# EAGLE design digit (EAGLE 6.1)
APVD: B.F. (15-01-03); DOC_ID: CLK-SCH-05; DOC_PART_NO: CLK-PC-05; DOC_REV: B; DOC_TITLE: Display (model B) - 7 seg. display; PROJECT_NAME: Alarm Clock (Model B)
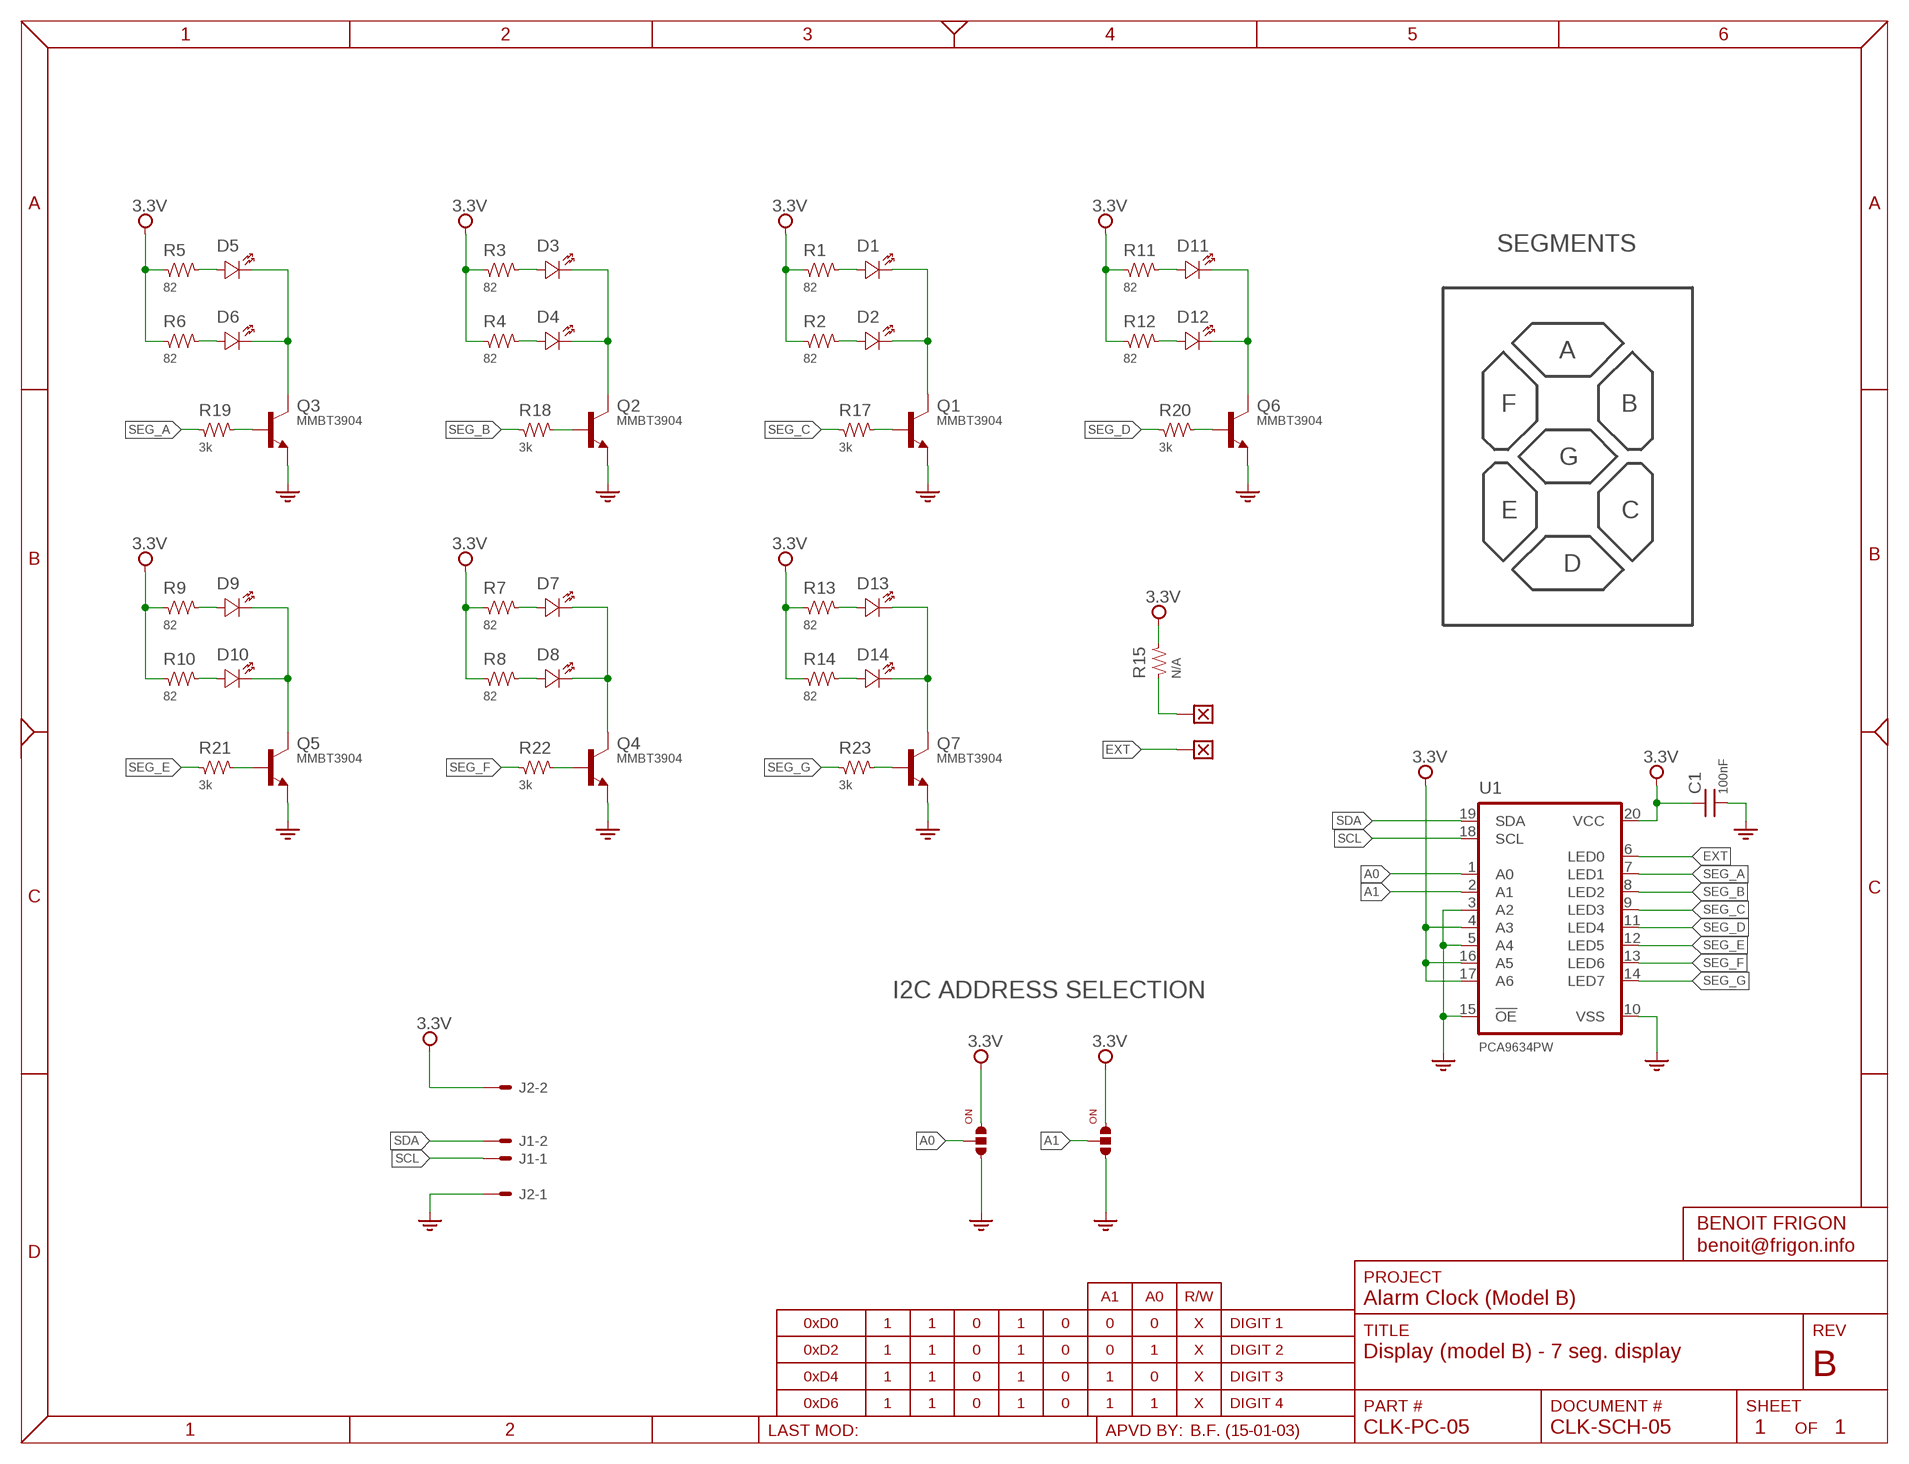
[diagram p0: schematic, sheet 1]

## Parts
C1  100nF  CAP-0603  [SMD_0603]
D1  Orange  LED-0805  [CHIPLED_0805]
D2  Orange  LED-0805  [CHIPLED_0805]
D3  Orange  LED-0805  [CHIPLED_0805]
D4  Orange  LED-0805  [CHIPLED_0805]
D5  Red  LED-0805  [CHIPLED_0805]
D6  orange  LED-0805  [CHIPLED_0805]
D7  Orange  LED-0805  [CHIPLED_0805]
D8  Orange  LED-0805  [CHIPLED_0805]
D9  Orange  LED-0805  [CHIPLED_0805]
D10  Orange  LED-0805  [CHIPLED_0805]
D11  Orange  LED-0805  [CHIPLED_0805]
D12  Orange  LED-0805  [CHIPLED_0805]
D13  Orange  LED-0805  [CHIPLED_0805]
D14  Orange  LED-0805  [CHIPLED_0805]
J1  DL-100-HEADER-02-EDGE  [HDR100-EDGE-2]
J2  DL-100-HEADER-02-EDGE  [HDR100-EDGE-2]
J10  SOLDER_JUMPER_3  [SOLDER_JUMPER_3]
J11  SOLDER_JUMPER_3  [SOLDER_JUMPER_3]
Q1  MMBT3904  [SOT23]
Q2  MMBT3904  [SOT23]
Q3  MMBT3904  [SOT23]
Q4  MMBT3904  [SOT23]
Q5  MMBT3904  [SOT23]
Q6  MMBT3904  [SOT23]
Q7  MMBT3904  [SOT23]
R1  82  RES-0603  [SMD_0603]
R2  82  RES-0603  [SMD_0603]
R3  82  RES-0603  [SMD_0603]
R4  82  RES-0603  [SMD_0603]
R5  82  RES-0603  [SMD_0603]
R6  82  RES-0603  [SMD_0603]
R7  82  RES-0603  [SMD_0603]
R8  82  RES-0603  [SMD_0603]
R9  82  RES-0603  [SMD_0603]
R10  82  RES-0603  [SMD_0603]
R11  82  RES-0603  [SMD_0603]
R12  82  RES-0603  [SMD_0603]
R13  82  RES-0603  [SMD_0603]
R14  82  RES-0603  [SMD_0603]
R15  N/A  RES-0603  [SMD_0603]
R17  3k  RES-0603  [SMD_0603]
R18  3k  RES-0603  [SMD_0603]
R19  3k  RES-0603  [SMD_0603]
R20  3k  RES-0603  [SMD_0603]
R21  3k  RES-0603  [SMD_0603]
R22  3k  RES-0603  [SMD_0603]
R23  3k  RES-0603  [SMD_0603]
U1  PCA9634PW  [TSSOP20]
W5  WIRE  [WIRE_SMT]
W6  WIRE  [WIRE_SMT]

## Nets
3.3V: C1.1 J2.2 J10.1 J11.1 R1.1 R2.1 R3.1 R4.1 R5.1 R6.1 R7.1 R8.1 R9.1 R10.1 R11.1 R12.1 R13.1 R14.1 R15.2 U1.4(A3) U1.16(A5) U1.17(A6) U1.20(VCC)
A0: J10.2 U1.1(A0)
A1: J11.2 U1.2(A1)
EXT: U1.6(LED0) W5.1
GND: C1.2 J2.1 J10.3 J11.3 Q1.2(E) Q2.2(E) Q3.2(E) Q4.2(E) Q5.2(E) Q6.2(E) Q7.2(E) U1.3(A2) U1.5(A4) U1.10(VSS) U1.15(!OE)
N$1: Q1.1(B) R17.2
N$2: D7.K D8.K Q4.3(C)
N$3: D13.K D14.K Q7.3(C)
N$4: D1.K D2.K Q1.3(C)
N$5: D3.K D4.K Q2.3(C)
N$6: D5.K D6.K Q3.3(C)
N$7: D3.A R3.2
N$8: D4.A R4.2
N$9: D14.A R14.2
N$10: D13.A R13.2
N$11: D2.A R2.2
N$12: D1.A R1.2
N$13: D5.A R5.2
N$14: D6.A R6.2
N$15: D11.A R11.2
N$16: D9.K D10.K Q5.3(C)
N$17: D11.K D12.K Q6.3(C)
N$18: D12.A R12.2
N$19: D10.A R10.2
N$20: D9.A R9.2
N$21: D7.A R7.2
N$22: D8.A R8.2
N$23: Q2.1(B) R18.2
N$24: Q3.1(B) R19.2
N$25: Q6.1(B) R20.2
N$26: Q5.1(B) R21.2
N$27: Q4.1(B) R22.2
N$28: Q7.1(B) R23.2
N$30: R15.1 W6.1
SCL: J1.1 U1.18(SCL)
SDA: J1.2 U1.19(SDA)
SEG_A: R19.1 U1.7(LED1)
SEG_B: R18.1 U1.8(LED2)
SEG_C: R17.1 U1.9(LED3)
SEG_D: R20.1 U1.11(LED4)
SEG_E: R21.1 U1.12(LED5)
SEG_F: R22.1 U1.13(LED6)
SEG_G: R23.1 U1.14(LED7)

## Notes on the sheet
- SEGMENTS
- A
- F | B
- G
- E | C
- D
- I2C ADDRESS SELECTION

## Library data of the parts
C1 = Passive:CAP: Capacitor; DESCRIPTION: {DESCRIPTION} - SMT 0603 - {value}; PACKAGE: SMT 0603
D1-D14 = Optoelectronic:LED: Led; COLOR: Orange; DESCRIPTION: {DESCRIPTION} Chip 0805 - {ATTR:COLOR}; MFG: Kingbright; PACKAGE: SMT 0805; PART_NO: APT2012SECK/J4-PRV; VALUE: {ATTR:COLOR}
J1 J2 = Connectors:DL-100-HEADER-02: 2 Pos - Dual Row - 2.54mm; MFG: Molex; PART_NO: 3-644456-2
J10 J11 = Misc:SOLDER_JUMPER_3; BOM: False; SKU: -
Q1-Q7 = Transistor:MMBT3904: NPN Transistor
R1-R15 R17-R23 = Passive:RES: Resistor; DESCRIPTION: {DESCRIPTION} - SMT 0603 - {VALUE}; PACKAGE: SMT 0603
U1 = IC:PCA9634: 8-bit fm+ i2c-bus LED driver The PCA9634 is an I2C-bus controlled 8-bit LED driver optimized for Red/Green/Blue/Amber (RGBA) color mixing applications. Each LED output has its own 8-bit resolution (256 steps) fixed frequency Individual PWM controller that operates at 97 kHz with a duty cycle that is adjustable from 0 % to 99.6 % to allow the LED to be set to a specific brightness value. An additional 8-bit resolution (256 steps) Group PWM controller has both a fixed frequency of 190 Hz and an adjustable frequency between 24 Hz to once every 10.73 seconds with a duty cycle that is adjustable from 0 % to 99.6 % that is used to either dim or blink all LEDs with the same value. Features 8 LED drivers. Each output programmable at: Off On Programmable LED brightness Programmable group dimming/blinking mixed with individual LED brightness 1 MHz Fast-mode Plus compatible I2C-bus interface with 30 mA high drive capability on SDA output for driving high capacitive buses 256-step (8-bit) linear programmable brightness per LED output varying from fully off (default) to maximum brightness using a 97 kHz PWM signal 256-step group brightness control allows general dimming (using a 190 Hz PWM signal) from fully off to maximum brightness (default) 256-step group blinking with frequency programmable from 24 Hz to 10.73 s and duty cycle from 0 % to 99.6 % Eight totem-pole outputs (sink 25 mA and source 10 mA at 5 V) with software programmable open-drain LED outputs selection (default at totem-pole). No input function. Output state change programmable on the Acknowledge or the STOP Command to update outputs byte-by-byte or all at the same time (default to ‘Change on STOP’). Active LOW Output Enable (OE) input pin. LED outputs programmable to 1, 0 or ‘high-impedance’ (default at power-up) when OE is HIGH, thus allowing hardware blinking and dimming of the LEDs. 7 hardware address pins allow 126 devices to be connected to the same I2C-bus 4 software programmable I2C-bus addresses (one LED Group Call address and three LED Sub Call addresses) allow groups of devices to be addressed at the same time in any combination (for example, one register used for ‘All Call’ so that all the PCA9634s on the I2C-bus can be addressed at the same time and the second register used for three different addresses so that 1⁄3 of all devices on the bus can be addressed at the same time in a group). Software enable and disable for I2C-bus address. Software Reset feature (SWRST Call) allows the device to be reset through the I2C-bus 25 MHz internal oscillator requires no external components Internal power-on reset Noise filter on SDA/SCL inputs Edge rate control on outputs No glitch on power-up Supports hot insertion Low standby current Operating power supply voltage range of 2.3 V to 5.5 V 5.5 V tolerant inputs; MFG: NXP Semiconductors
W5 W6 = Misc:WIRE; BOM: False

## Board
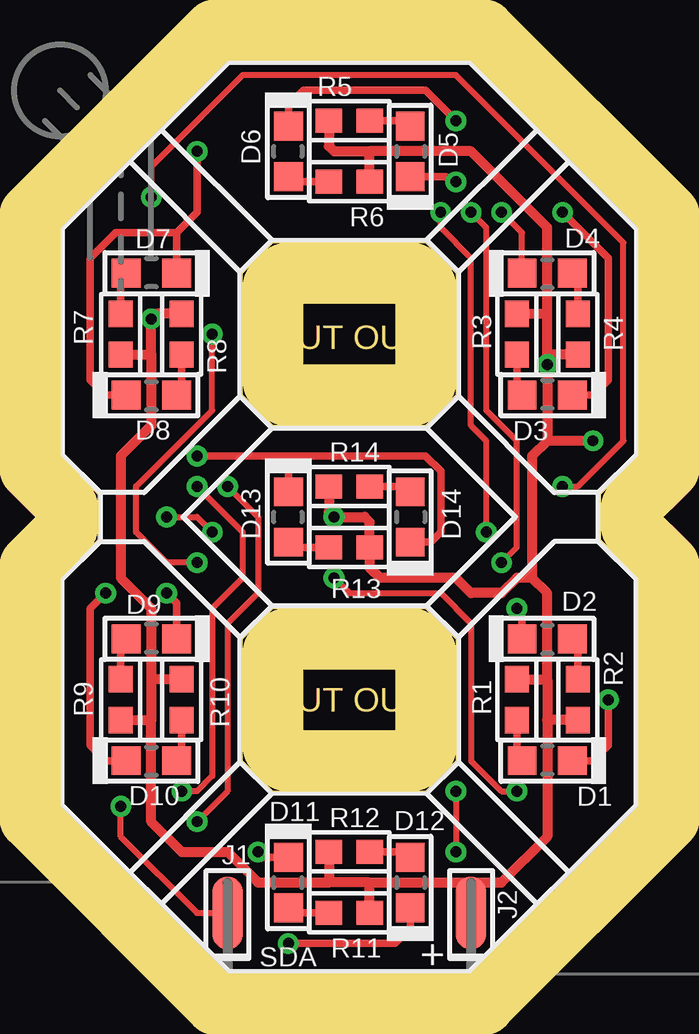
[diagram p1: board, top side]
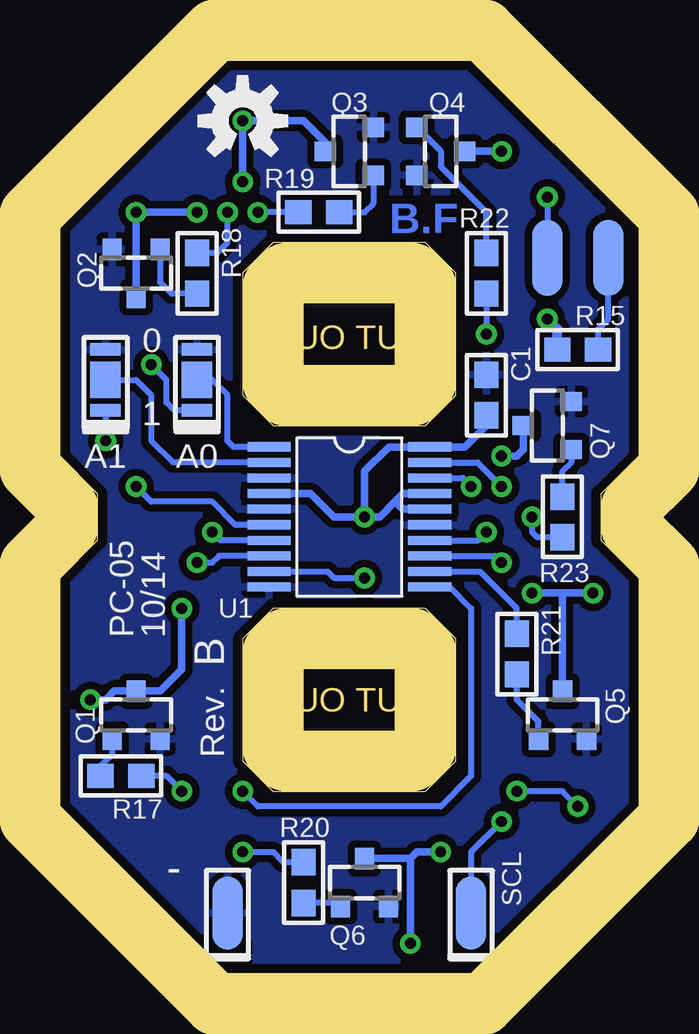
[diagram p2: board, bottom side, seen from below]

Size 24.13 x 38.1 mm. Coordinates in mm from the lower left corner, seen from the top.
Outline: 6.99,0 17.14,0 24.13,6.99 24.13,16.51 22.55,18.09 22.55,20.02 24.13,21.59 24.13,31.11 17.14,38.1 6.99,38.1 0,31.11 0,21.59 1.57,20.02 1.57,18.09 0,16.51 0,6.99 6.99,0
Outline: 8.89,7.62 7.62,8.89 7.62,13.97 8.89,15.24 15.24,15.24 16.51,13.97 16.51,8.89 15.24,7.62 8.89,7.62
Outline: 15.24,22.86 8.89,22.86 7.62,24.13 7.62,29.21 8.89,30.48 15.24,30.48 16.51,29.21 16.51,24.13 15.24,22.86
Copper layers (1*16): Top 0.035mm / dielectric 1.5mm / Bottom 0.035mm
Design rules: minimum track width 8mil, minimum drill 16mil, track to track 8mil, track to pad 8mil, pad to pad 8mil, via to via 8mil, smd to smd 8mil, copper to edge 16mil, drill to drill 8mil, minimum pad ring 10mil, minimum via ring 8mil, stop-mask expansion 4mil, vias tented up to drill 24mil, thermal gap 10mil
bRestrict: area 6.3,-0.6 to 7.6,1.3; area 16.5,-0.6 to 17.8,1.3
Milling: 33 lines

### Footprints (pad centres in the part's own frame; a part is rotated, then mirrored left to right if it is on the bottom)
SMD_0603 = smd 1.1 x 1: 1 -0.85,0; 2 0.85,0
CHIPLED_0805 = smd 1.2 x 1.2: A 0,-1.05; K 0,1.05
HDR100-EDGE-2 = smd 1.27 x 3.048 bottom: 1 0,0 | smd 1.27 x 3.048: 2 0,0
SOLDER_JUMPER_3 = smd 0.508 x 1.27: 1 -1.27,0; 3 1.27,0 | smd 1.524 x 1.27: 2 0,0
SOT23 = smd 0.8 x 0.9: 1 -1,-1; 2 1,-1; 3 0,1
TSSOP20 = smd 0.38 x 1.8: 1 -2.925,-3.35; 2 -2.275,-3.35; 3 -1.625,-3.35; 4 -0.975,-3.35; 5 -0.325,-3.35; 6 0.325,-3.35; 7 0.975,-3.35; 8 1.625,-3.35; 9 2.275,-3.35; 10 2.925,-3.35; 11 2.925,3.35; 12 2.275,3.35; 13 1.625,3.35; 14 0.975,3.35; 15 0.325,3.35; 16 -0.325,3.35; 17 -0.975,3.35; 18 -1.625,3.35; 19 -2.275,3.35; 20 -2.925,3.35
WIRE_SMT = smd 3.175 x 1.27: 1 0,0

### Placement (x,y rotation side)
C1  6.35,24.13 90 bottom
D1  20.32,8.89 270 top
D2  20.32,13.97 90 top
D3  20.32,24.13 270 top
D4  20.32,29.21 90 top
D5  14.61,34.29 180 top
D6  9.53,34.29 0 top
D7  3.81,29.21 270 top
D8  3.81,24.13 90 top
D9  3.81,13.97 270 top
D10  3.81,8.89 90 top
D11  9.53,3.81 0 top
D12  14.61,3.81 180 top
D13  9.53,19.05 0 top
D14  14.61,19.05 180 top
J1  6.99,2.54 0 top
J2  17.14,2.54 0 top
J10  18.41,24.77 90 bottom
J11  22.23,24.77 90 bottom
Q1  20.95,10.79 0 bottom
Q2  20.95,29.21 180 bottom
Q3  12.06,34.29 90 bottom
Q4  8.26,34.29 270 bottom
Q5  3.17,10.79 0 bottom
Q6  11.43,3.81 0 bottom
Q7  3.81,22.86 90 bottom
R1  19.05,11.43 270 top
R2  21.59,11.43 90 top
R3  19.05,26.67 270 top
R4  21.59,26.67 90 top
R5  12.06,35.56 0 top
R6  12.06,33.02 180 top
R7  2.54,26.67 90 top
R8  5.08,26.67 270 top
R9  2.54,11.43 90 top
R10  5.08,11.43 270 top
R11  12.06,2.54 180 top
R12  12.06,5.08 0 top
R13  12.06,17.78 180 top
R14  12.06,20.32 0 top
R15  2.54,26.04 180 bottom
R17  21.59,8.26 180 bottom
R18  18.41,29.21 270 bottom
R19  13.34,31.75 0 bottom
R20  13.97,3.81 270 bottom
R21  5.08,13.34 270 bottom
R22  6.35,29.21 90 bottom
R23  3.17,19.05 90 bottom
U1  12.06,19.05 270 bottom
U$1  [OPENHW_LOGO_150]  16.51,35.56 0 bottom
U$2  [INFO_AUTHOR]  8.95,31.5 0 bottom
U$3  [INFO_REV]  17.27,9.02 90 bottom
W5  3.81,29.84 90 bottom
W6  1.27,29.84 270 bottom

### Tracks (layer width: path | path; a pad name or v marks a point on that pad's centre or on a via)
3.3V  (via drill 0.46)
  Top 0.406: 11.21,3.81 8.26,3.81 6.99,5.08 5.08,5.08 3.81,6.35 3.81,10.58 | 12.91,3.81 17.14,3.81 | R12.1 11.21,3.81 | R11.1 12.91,3.81 | 12.91,3.81 11.21,3.81 | R2.1 20.32,10.58 | 20.32,10.58 20.32,5.71 18.41,3.81 17.14,3.81 | 20.32,12.28 20.32,15.88 19.68,16.51 | 20.32,27.52 20.32,31.11 17.14,34.29 12.91,34.29 | R3.1 20.32,27.52 | R4.1 20.32,25.82 | 20.32,25.82 20.32,27.52 | R9.1 3.81,10.58 | R1.1 20.32,12.28 | 20.32,12.28 20.32,10.58 | R7.1 3.81,25.82 | R6.1 12.91,34.29 | 12.91,34.29 11.43,34.29 11.21,34.51 R5.1 | R14.1 11.21,19.27 v11.43,19.05 12.7,19.05 12.91,18.84 R13.1 12.91,16.93 13.34,16.51 16.51,16.51 17.14,15.88 18.41,15.88 19.05,16.51 19.68,16.51 | 3.81,25.82 3.81,22.86 2.54,21.59 2.54,16.51 3.81,15.24 3.81,12.28 | 20.32,25.82 v20.32,25.4 20.32,22.23 | 20.32,22.23 19.68,21.59 19.68,16.51 | R10.1 3.81,12.28 | 3.81,12.28 3.81,10.58 | 3.81,25.82 v3.81,27.3 4.03,27.52 R8.1 | v22.23,22.23 20.32,22.23 | J2.2 17.14,3.81
  Bottom 0.254: J11.1 v22.23,22.23 | v20.32,25.4 19.68,24.77 19.68,23.81 19.37,23.5 J10.1
  Bottom 0.305: v11.43,19.05 10.79,19.05 10.16,19.68 | U1.17 9.82,20.02 10.16,19.68 | U1.16 9.85,19.38 10.16,19.68 | v11.43,19.05 11.43,20.95 10.41,21.98 U1.20 7.24,21.98 6.35,22.86 C1.1 | U1.4 13.68,20.02 12.7,19.05 v11.43,19.05
  Bottom 0.406: R15.2 3.39,26.89 v3.81,27.3
A0
  Bottom 0.254: U1.1 16.89,21.98 17.14,22.23 17.14,24.13 17.78,24.77 J10.2
A1
  Bottom 0.254: J11.2 20.95,24.77 20.32,24.13 20.32,22.23 19.42,21.32 U1.2
EXT  (via drill 0.46)
  Top 0.254: v20.95,20.32 21.59,20.32 23.5,22.23 23.5,30.48 16.51,37.47 7.62,37.47 3.81,33.66 v3.81,32.38
  Bottom 0.254: U1.6 16.82,18.73 17.78,19.68 20.32,19.68 v20.95,20.32 | v3.81,32.38 W5.1
GND
  pour Bottom (isolate 0.305, rank 3): 6.99,0 0,6.99 0,31.11 6.99,38.1 17.14,38.1 24.13,31.11 24.13,6.99 17.14,0
N$1
  Bottom 0.254: R17.2 22.44,8.68 21.95,9.16 Q1.1
N$2  (via drill 0.46)
  Top 0.305: D8.K 1.91,24.13 1.27,24.77 1.27,29.84 2.32,30.89 4.86,30.89 | v5.71,34.29 5.71,31.75 4.86,30.89 | D7.K 4.86,30.89
  Bottom 0.305: Q4.3 v5.71,34.29
N$3  (via drill 0.46)
  Top 0.305: 9.53,21.59 15.24,21.59 15.88,20.95 15.88,18.41 15.46,18 D14.K | 9.53,21.59 9.53,20.32 | 9.53,21.59 v5.71,21.59
  Top 0.406: D13.K 9.53,20.32
  Bottom 0.305: v5.71,21.59 5.08,21.59 4.81,21.86 Q7.3
N$4  (via drill 0.46)
  Top 0.305: D1.K 22.23,8.89 22.86,9.53 v22.86,11.43 | D2.K 19.27,15.02 v19.05,15.24
  Bottom 0.305: v22.86,11.43 22.23,11.43 21.86,11.79 Q1.3 19.95,11.79 19.05,12.7 v19.05,15.24
N$5  (via drill 0.46)
  Top 0.254: D4.K 19.27,30.89 v18.41,31.75
  Top 0.305: D3.K 22.23,24.13 22.86,24.77 22.86,29.84 v20.95,31.75
  Bottom 0.305: v18.41,31.75 v20.95,31.75 Q2.3
N$6  (via drill 0.46)
  Top 0.305: D6.K 9.53,36.2 10.16,36.83 15.24,36.83 v16.51,35.56 | D5.K 16.09,33.24 16.32,33.02 v16.51,33.02
  Bottom 0.305: v16.51,33.02 v16.51,35.56 13.97,35.56 13.06,34.66 Q3.3
N$7
  Top 0.305: D3.A 19.05,24.13 R3.2
N$8
  Top 0.305: D4.A 21.59,29.21 R4.2
N$9
  Top 0.305: R14.2 14.61,20.32 D14.A
N$10
  Top 0.305: R13.2 9.53,17.78 D13.A
N$11
  Top 0.305: D2.A 21.59,13.97 R2.2
N$12
  Top 0.305: D1.A 19.05,8.89 R1.2
N$13
  Top 0.305: R5.2 14.61,35.56 D5.A
N$14
  Top 0.305: R6.2 9.53,33.02 D6.A
N$15
  Top 0.305: R11.2 9.53,2.54 D11.A
N$16  (via drill 0.46)
  Top 0.305: v1.91,15.88 1.27,15.24 1.27,9.53 1.91,8.89 D10.K 2.54,8.89 | D9.K 4.86,15.46 v4.45,15.88
  Bottom 0.305: v1.91,15.88 3.17,15.88 | 3.17,15.88 v4.45,15.88 | Q5.3 3.17,15.88
N$17  (via drill 0.46)
  Top 0.305: D12.K 14.61,1.91 13.97,1.27 v9.53,1.27 | D11.K 8.47,4.86 v8.26,5.08
  Bottom 0.305: 9.53,2.54 v9.53,1.27 9.53,4.81 | Q6.3 9.53,4.81 | 9.53,4.81 9.26,5.08 v8.26,5.08
N$18
  Top 0.305: R12.2 14.61,5.08 D12.A
N$19
  Top 0.305: D10.A 5.08,8.89 R10.2
N$20
  Top 0.305: D9.A 2.54,13.97 R9.2
N$21
  Top 0.305: D7.A 2.54,29.21 R7.2
N$22
  Top 0.305: D8.A 5.08,24.13 R8.2
N$23
  Bottom 0.254: R18.2 19.47,28.36 19.95,28.84 Q2.1
N$24
  Bottom 0.254: R19.2 11.43,31.75 11.06,32.12 Q3.1
N$25
  Bottom 0.254: Q6.1 12.43,2.96 R20.2
N$26
  Bottom 0.254: Q5.1 4.17,10.53 5.08,11.43 R21.2
N$27
  Bottom 0.254: R22.2 6.35,31.75 8.26,33.66 8.26,34.29 Q4.1
N$28
  Bottom 0.254: Q7.1 2.81,21.32 3.17,20.95 R23.2
N$30
  Bottom 0.254: R15.1 1.69,26.89 1.27,27.3 W6.1
SCL  (via drill 0.46)
  Top 0.254: v6.99,20.32 8.26,19.05 8.26,15.88 6.99,14.61 6.99,7.62 v5.71,6.35
  Bottom 0.254: U1.18 7.34,20.68 v6.99,20.32 | v5.71,6.35 6.99,5.08 J1.1
SDA  (via drill 0.46)
  Top 0.254: v5.71,20.32 7.62,18.41 7.62,16.51 6.35,15.24 6.35,8.26 5.71,7.62 v5.08,7.62 | v2.54,6.99 2.54,5.71 5.71,2.54 J1.2
  Bottom 0.254: U1.19 6.72,21.32 v5.71,20.32 | v2.54,6.99 3.17,7.62 v5.08,7.62
SEG_A  (via drill 0.46)
  Top 0.254: v17.78,18.41 17.78,22.23 17.14,22.86 17.14,29.84 15.88,31.11 v15.88,31.75
  Bottom 0.254: R19.1 v15.88,31.75 | U1.7 17.44,18.07 v17.78,18.41
SEG_B  (via drill 0.46)
  Top 0.254: v18.41,17.14 19.05,17.78 19.05,22.23 17.78,23.5 17.78,31.11 v17.14,31.75
  Bottom 0.254: R18.1 17.57,30.06 17.14,30.48 v17.14,31.75 | v18.41,17.14 17.78,17.14 17.5,17.43 U1.8
SEG_C  (via drill 0.46)
  Top 0.254: v11.43,16.51 12.06,15.88 15.88,15.88 17.14,14.61 17.14,8.89 18.41,7.62 v19.05,7.62
  Bottom 0.254: U1.9 12.96,16.77 12.7,16.51 v11.43,16.51 | v19.05,7.62 19.68,8.26 R17.1
SEG_D  (via drill 0.46)
  Top 0.254: v16.51,7.62 v16.51,5.08
  Bottom 0.254: U1.11 7.87,16.12 6.99,15.24 6.99,8.26 8.26,6.99 15.88,6.99 v16.51,7.62 | v16.51,5.08 15.24,5.08 14.82,4.66 R20.1
SEG_E
  Bottom 0.254: U1.12 6.62,16.77 5.08,15.24 R21.1
SEG_F  (via drill 0.46)
  Top 0.254: v6.35,26.67 6.35,23.5 3.17,20.32 3.17,18.41 4.45,17.14 v5.71,17.14
  Bottom 0.254: U1.13 6,17.43 v5.71,17.14 | R22.1 v6.35,26.67
SEG_G  (via drill 0.46)
  Top 0.254: v4.45,19.05 5.71,19.05 v6.35,18.41
  Bottom 0.254: U1.14 6.69,18.07 v6.35,18.41 | v4.45,19.05 4.45,18.41 4.23,18.2 R23.1

### Text on the board
Dimension: CUT OUT | CUT OUT
tPlace: SDA | +
bPlace: 0 | 1 | A0 | A1 | SCL | -
tDocu: BASE PCB
_tsilk: R5 | D5 | D6 | R6 | D4 | D7 | R3 | R7 | R8 | R4 | D8 | D3 | R14 | D14 | D13 | R13 | D9 | D2 | R10 | R1 | R2 | R9 | D10 | D1 | D11 | R12 | D12 | J1 | J2 | R11 | SDA | +
_bsilk: Q4 | Q3 | R19 | R22 | R18 | Q2 | R15 | C1 | 0 | Q7 | 1 | A0 | A1 | R23 | R21 | U1 | 10/14 | PC-05 | B | Q5 | Q1 | Rev. | R20 | R17 | SCL | - | Q6